# EAGLE design Remote Monitoring Hardware (EAGLE 8.1.0)
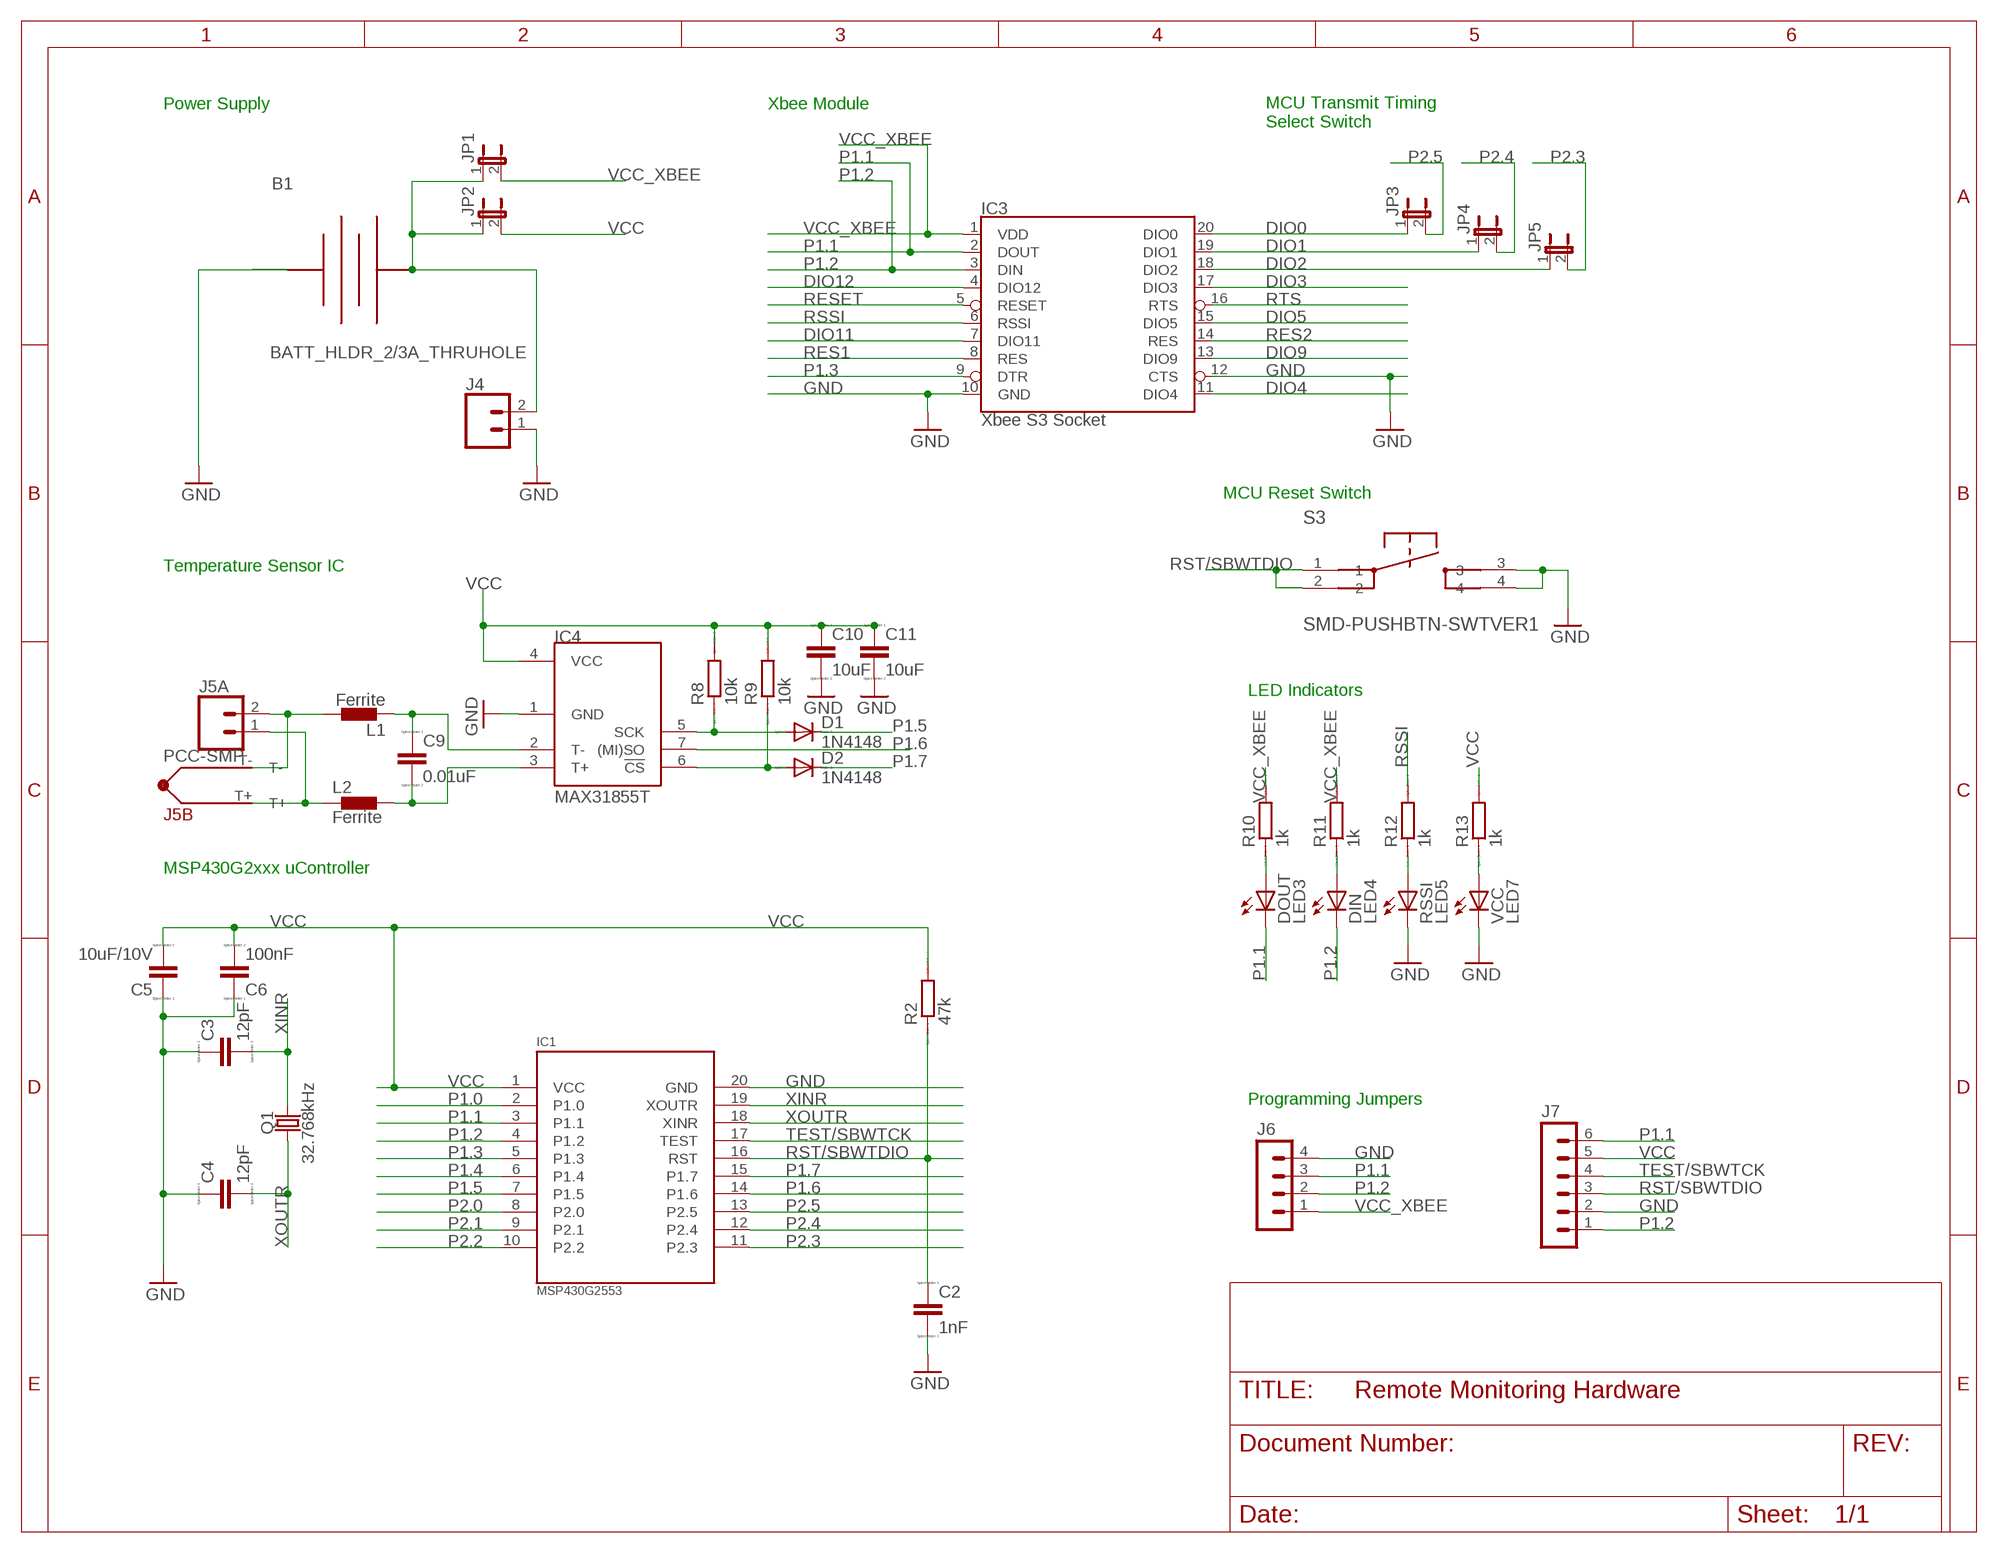
[diagram p0: schematic, sheet 1]

## Parts
B1  BATT_HLDR_2/3A_THRUHOLE  [BATT_HLDR_2/3A_THRUHOLE]
C2  1nF  C  [C0805]
C3  12pF  C  [C0805]
C4  12pF  C  [C0805]
C5  10uF/10V  C  [C0805]
C6  100nF  C  [C0805]
C9  0.01uF  C  [C0805]
C10  10uF  C  [C0805]
C11  10uF  C  [C0805]
D1  1N4148  DIODE-SOD323-R  [SOD323-R]
D2  1N4148  DIODE-SOD323-R  [SOD323-R]
DIN  LED4  LEDSML0805  [SML0805]
DOUT  LED3  LEDSML0805  [SML0805]
IC1  MSP430G2553  MSP430G2553IPW20VER2TSSOP-20  [MSP430G2553IPW20]
IC3  Xbee S3 Socket  XBEELONGPAD  [XBEE-LONGPAD]
IC4  MAX31855T  MAX6675  [SOIC8]
J4  CONN_023.5MM  [SCREWTERMINAL-3.5MM-2]
J5A  CONN_023.5MM  [SCREWTERMINAL-3.5MM-2]
J5B  PCC-SMP  [PCC-SMP]
J6  MA04-1  [MA04-1]
J7  MA06-1  [MA06-1]
JP1  JUMPER-2PTH  [1X02]
JP2  JUMPER-2PTH  [1X02]
JP3  JUMPER-2PTH  [1X02]
JP4  JUMPER-2PTH  [1X02]
JP5  JUMPER-2PTH  [1X02]
L1  Ferrite  BLM15HB121SN1  [0402]
L2  Ferrite  BLM15HB121SN1  [0402]
Q1  32.768kHz  CRYSTAL-32.768KHZSMD-2X6  [CRYSTAL-SMD-2X6-CYL]
R2  47k  R  [R0805]
R8  10k  R  [R0805]
R9  10k  R  [R0805]
R10  1k  R  [R0805]
R11  1k  R  [R0805]
R12  1k  R  [R0805]
R13  1k  R  [R0805]
RSSI  LED5  LEDSML0805  [SML0805]
S3  SMD-PUSHBTN-SWTVER1  [KPT-1187B]
VCC  LED7  LEDSML0805  [SML0805]

## Nets
1: D1.A IC4.5(SCK) R8.1
2: D2.A IC4.6(!CS) R9.1
DIO0: IC3.20(DIO0) JP3.1
DIO1: IC3.19(DIO1) JP4.1
DIO2: IC3.18(DIO2) JP5.1
DIO3: IC3.17(DIO3)
DIO4: IC3.11(DIO4)
DIO5: IC3.15(DIO5)
DIO9: IC3.13(DIO9)
DIO11: IC3.7(DIO11)
DIO12: IC3.4(DIO12)
GND: B1.NEG C2.2 C3.1 C4.1 C5.1 C6.1 C10.2 C11.2 IC1.20(GND) IC3.10(GND) IC3.12(CTS) IC4.1(GND) J4.1 J6.4 J7.2 RSSI.C S3.3 S3.4 VCC.C
N$1: B1.POS J4.2 JP1.1 JP2.1
N$4: DOUT.A R10.1
N$10: DIN.A R11.1
N$11: R12.1 RSSI.A
N$12: C9.1 IC4.2(T-) L1.1
N$13: C9.2 IC4.3(T+) L2.2
N$14: J5A.2 J5B.T- L1.2
N$15: J5A.1 J5B.T+ L2.1
N$17: R13.1 VCC.A
P1.0: IC1.2(P1.0)
P1.1: DOUT.C IC1.3(P1.1) IC3.2(DOUT) J6.3 J7.6
P1.2: DIN.C IC1.4(P1.2) IC3.3(DIN) J6.2 J7.1
P1.3: IC1.5(P1.3) IC3.9(DTR)
P1.4: IC1.6(P1.4)
P1.5: D1.C IC1.7(P1.5)
P1.6: IC1.14(P1.6) IC4.7((MI)SO)
P1.7: D2.C IC1.15(P1.7)
P2.0: IC1.8(P2.0)
P2.1: IC1.9(P2.1)
P2.2: IC1.10(P2.2)
P2.3: IC1.11(P2.3) JP5.2
P2.4: IC1.12(P2.4) JP4.2
P2.5: IC1.13(P2.5) JP3.2
RES1: IC3.8(RES)
RES2: IC3.14(RES)
RESET: IC3.5(RESET)
RSSI: IC3.6(RSSI) R12.2
RST/SBWTDIO: C2.1 IC1.16(RST) J7.3 R2.1 S3.1 S3.2
RTS: IC3.16(RTS)
TEST/SBWTCK: IC1.17(TEST) J7.4
VCC: C5.2 C6.2 C10.1 C11.1 IC1.1(VCC) IC4.4(VCC) J7.5 JP2.2 R2.2 R8.2 R9.2 R13.2
VCC_XBEE: IC3.1(VDD) J6.1 JP1.2 R10.2 R11.2
XINR: C3.2 IC1.19(XOUTR) Q1.X2
XOUTR: C4.2 IC1.18(XINR) Q1.X1

## Notes on the sheet
- Power Supply | Xbee Module
- MCU Transmit Timing 
  Select Switch
- MCU Reset Switch
- Temperature Sensor IC
- LED Indicators
- MSP430G2xxx uController
- Programming Jumpers

## Library data of the parts
B1 = custom parts:BATT_HLDR_2/3A_THRUHOLE
C2-C6 C9-C11 = eagle-ltspice:C: CAPACITOR, European symbol; SPICEMODEL: NONE; SPICEPREFIX: C
D1 D2 = diode:DIODE-: DIODE
DIN DOUT RSSI VCC = led:LED: LED OSRAM: - CHIPLED LG R971, LG N971, LY N971, LG Q971, LY Q971, LO R971, LY R971 LH N974, LH R974 LS Q976, LO Q976, LY Q976 LO Q996 - Hyper CHIPLED LW Q18S LB Q993, LB Q99A, LB R99A - SideLED LS A670, LO A670, LY A670, LG A670, LP A670 LB A673, LV A673, LT A673, LW A673 LH A674 LY A675 LS A676, LA A676, LO A676, LY A676, LW A676 LS A679, LY A679, LG A679 - Hyper Micro SIDELED® LS Y876, LA Y876, LO Y876, LY Y876 LT Y87S - SmartLED LW L88C, LW L88S LB L89C, LB L89S, LG L890 LS L89K, LO L89K, LY L89K LS L896, LA L896, LO L896, LY L896 - TOPLED LS T670, LO T670, LY T670, LG T670, LP T670 LSG T670, LSP T670, LSY T670, LOP T670, LYG T670 LG T671, LOG T671, LSG T671 LB T673, LV T673, LT T673, LW T673 LH T674 LS T676, LA T676, LO T676, LY T676, LB T676, LH T676, LSB T676, LW T676 LB T67C, LV T67C, LT T67C, LS T67K, LO T67K, LY T67K, LW E67C LS E67B, LA E67B, LO E67B, LY E67B, LB E67C, LV E67C, LT E67C LW T67C LS T679, LY T679, LG T679 LS T770, LO T770, LY T770, LG T770, LP T770 LB T773, LV T773, LT T773, LW T773 LH T774 LS E675, LA E675, LY E675, LS T675 LS T776, LA T776, LO T776, LY T776, LB T776 LHGB T686 LT T68C, LB T68C - Hyper Mini TOPLED® LB M676 - Mini TOPLED Santana® LG M470 LS M47K, LO M47K, LY M47K Source: http://www.osram.convergy.de LUXEON: - LUMILED® LXK2-PW12-R00, LXK2-PW12-S00, LXK2-PW14-U00, LXK2-PW14-V00 LXK2-PM12-R00, LXK2-PM12-S00, LXK2-PM14-U00 LXK2-PE12-Q00, LXK2-PE12-R00, LXK2-PE12-S00, LXK2-PE14-T00, LXK2-PE14-U00 LXK2-PB12-K00, LXK2-PB12-L00, LXK2-PB12-M00, LXK2-PB14-N00, LXK2-PB14-P00, LXK2-PB14-Q00 LXK2-PR12-L00, LXK2-PR12-M00, LXK2-PR14-Q00, LXK2-PR14-R00 LXK2-PD12-Q00, LXK2-PD12-R00, LXK2-PD12-S00 LXK2-PH12-R00, LXK2-PH12-S00 LXK2-PL12-P00, LXK2-PL12-Q00, LXK2-PL12-R00 Source: www.luxeon.com KINGBRIGHT: KA-3528ASYC Source: www.kingbright.com
IC1 = custom parts:MSP430G2553IPW20VER2
IC3 = SparkFun-RF:XBEE: Digi XBee and XBee Pro XBees are tiny blue chips that can communicate wirelessly with each other. They can do simple things, like replacing a couple of wires in serial communication, which is nice when you want to make a remote for your paintball vehicle. SparkFun Products SparkFun XBee Buying Guide <https://www.sparkfun.com/pages/xbee_guide> SparkFun XBee Explorer USB <https://www.sparkfun.com/products/11812> (WRL-11812) Breakout Board for XBee Module <https://www.sparkfun.com/products/8276> (WRL-8276) SparkFun XBee Explorer Regulated <https://www.sparkfun.com/products/11373> (WRL-11373) SparkFun XBee Explorer Dongle <https://www.sparkfun.com/products/11697> (WRL-11697) SparkFun XBee Shield <https://www.sparkfun.com/products/12847> (WRL-12847) SparkFun XBee Explorer Serial <https://www.sparkfun.com/products/13225> (WRL-13225)
IC4 = SparkFun-Retired:MAX6675: Cold-Junction-Compensated K-Thermocoupleto-Digital Converter (0°C to +1024°C) The MAX6675 performs cold-junction compensation and digitizes the signal from a type-K thermocouple. The data is output in a 12-bit resolution, SPI™-compatible, read-only format. This converter resolves temperatures to 0.25°C, allows readings as high as +1024°C, and exhibits thermocouple accuracy of 8LSBs for temperatures ranging from 0°C to +700°C. Dead Prototype: IC-12512; PROD_ID: IC-12512
J4 J5A = SparkFun-Connectors:CONN_02: Multi connection point. Often used as Generic Header-pin footprint for 0.1 inch spaced/style header connections On any of the 0.1 inch spaced packages, you can populate with these: Break Away Headers - Straight <https://www.sparkfun.com/products/116> (PRT-00116) Break Away Male Headers - Right Angle <https://www.sparkfun.com/products/553> (PRT-00553) Female Headers <https://www.sparkfun.com/products/115> (PRT-00115) Break Away Headers - Machine Pin <https://www.sparkfun.com/products/117> (PRT-00117) Break Away Female Headers - Swiss Machine Pin <https://www.sparkfun.com/products/743> (PRT-00743) For SCREWTERMINALS and SPRING TERMINALS visit here: Screw Terimnals on SparkFun.com <https://www.sparkfun.com/search/results?term=Screw+Terminals> (5mm/3.5mm/2.54mm spacing) This device is also useful as a general connection point to wire up your design to another part of your project. Our various solder wires solder well into these plated through hole pads. Hook-Up Wire - Assortment (Stranded, 22 AWG) <https://www.sparkfun.com/products/11375> (PRT-11375) Hook-Up Wire - Assortment (Solid Core, 22 AWG) <https://www.sparkfun.com/products/11367> (PRT-11367) View the entire wire category on our website here <https://www.sparkfun.com/categories/141> Special notes: Molex polarized connector foot print use with: PRT-08233 with associated crimp pins and housings. 2.54_SCREWTERM for use with PRT-10571. 3.5mm Screw Terminal footprints for PRT-08084 5mm Screw Terminal footprints for use with PRT-08432; PROD_ID: CONN-08399
J5B = custom parts:PCC-SMP
J6 = con-lstb:MA04-1: PIN HEADER; OC_FARNELL: unknown; OC_NEWARK: unknown
J7 = con-lstb:MA06-1: PIN HEADER; OC_FARNELL: unknown; OC_NEWARK: unknown
JP1-JP5 = SparkFun-Retired:JUMPER-2: Jumper Basic 0.1" spaced jumper. Use with breakaway headers.
L1 L2 = inductors:BLM15H: EMIFIL (R) Chip Ferrite Bead for GHz Noise Source: http://www.murata.com/ Ferrite Bead BLM15H.pdf
Q1 = SparkFun-Clocks:CRYSTAL-32.768KHZ: 32.768kHz Crystal Frequency: 32.768kHz Frequency Stability: ±20ppm Load Capacitance: 12.5pF (PTH-2X6 & SMD-3.2X1.5), 6pF (SMD-2X6) SparkFun Products: SparkFun BigTime Watch Kit <https://www.sparkfun.com/products/11734> SparkFun nRF52832 Breakout <https://www.sparkfun.com/products/13990> SparkFun Real Time Clock Module <https://www.sparkfun.com/products/12708>; PROD_ID: XTAL-07894
R2 R8-R13 = eagle-ltspice:R: RESISTOR, European symbol; SPICEMODEL: NONE; SPICEPREFIX: R
S3 = custom parts:SMD-PUSHBTN-SWT

## Net classes
0 default: width 0.203 mm, clearance 0.205 mm
1 vcc: width 0.305 mm

## Board
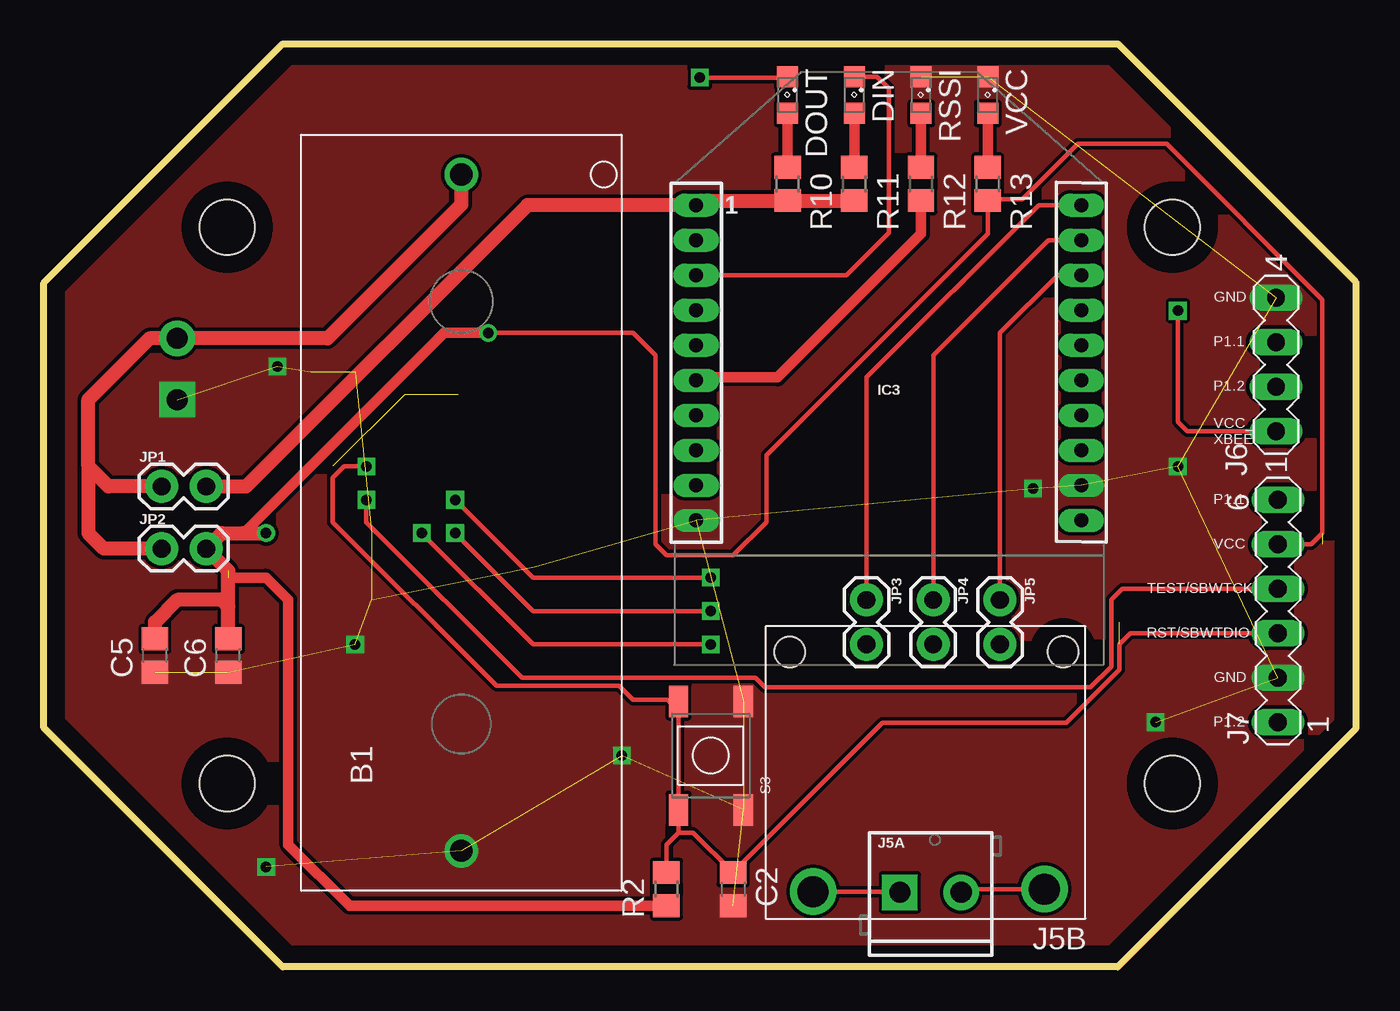
[diagram p1: board, top side]
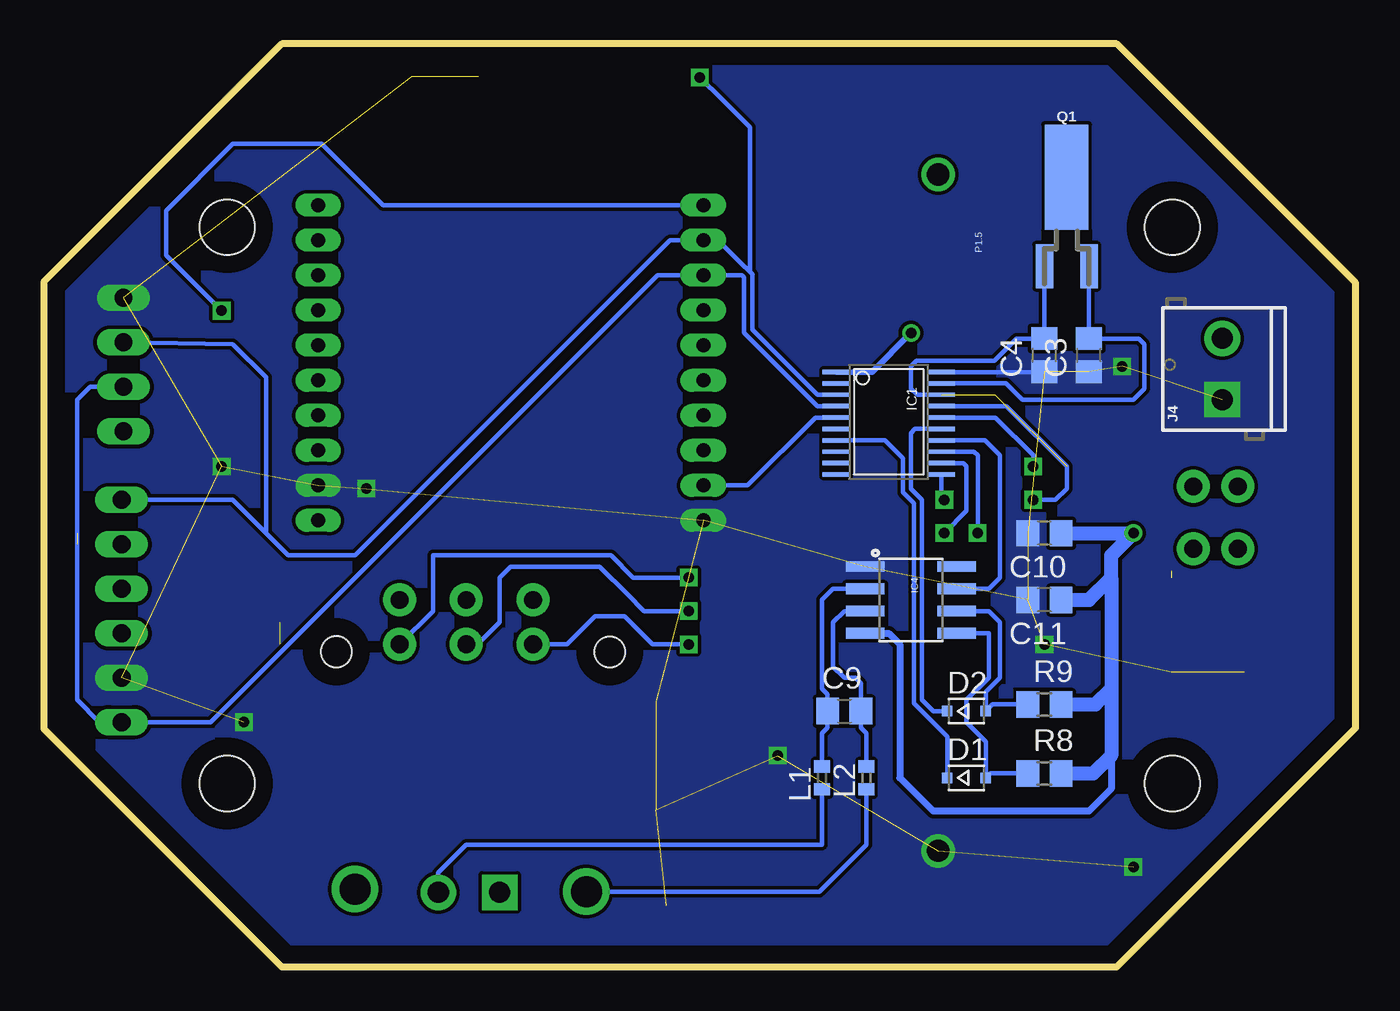
[diagram p2: board, bottom side, seen from below]

Size 74.93 x 52.7 mm. Coordinates in mm from the lower left corner, seen from the top.
Outline: 13.65,52.7 61.34,52.7 74.93,39.12 74.93,13.59 61.34,0 13.65,0 0,13.65 0,39.05 13.65,52.7
Copper layers (1*16): Top 0.035mm / dielectric 1.5mm / Bottom 0.035mm
Design rules "default *": minimum track width 7mil, minimum drill 7mil, track to track 5mil, track to pad 5mil, pad to pad 5mil, via to via 5mil, smd to smd 5mil, copper to edge 40mil, drill to drill 8mil, minimum pad ring 10mil, minimum via ring 8mil, stop-mask expansion 4mil, vias tented up to drill 0mil, thermal gap 10mil
Holes 3.17 mm at 10.48,42.23 64.45,42.23 64.45,10.48 10.48,10.48

### Footprints (pad centres in the part's own frame; a part is rotated, then mirrored left to right if it is on the bottom)
BATT_HLDR_2/3A_THRUHOLE = drill 1.27: NEG -19.05,0; POS 19.558,0
C0805 = smd 1.3 x 1.5: 1 -0.95,0; 2 0.95,0
SOD323-R = smd 0.6 x 0.6: A 1.1,0; C -1.1,0
SML0805 = smd 1.2 x 1.2: A 1.05,0; C -1.05,0
MSP430G2553IPW20 = smd 1.55 x 0.25: 1 -3,2.85; 2 -3,2.2; 3 -3,1.55; 4 -3,0.9; 5 -3,0.25; 6 -3,-0.4; 7 -3,-1.05; 8 -3,-1.7; 9 -3,-2.35; 10 -3,-3; 11 3,-3; 12 3,-2.35; 13 3,-1.7; 14 3,-1.05; 15 3,-0.4; 16 3,0.25; 17 3,0.9; 18 3,1.55; 19 3,2.2; 20 3,2.85
XBEE-LONGPAD = drill 0.8 pad 1.206 long: 1 -11,20; 2 -11,18; 3 -11,16; 4 -11,14; 5 -11,12; 6 -11,10; 7 -11,8; 8 -11,6; 9 -11,4; 10 -11,2; 11 11,2; 12 11,4; 13 11,6; 14 11,8; 15 11,10; 16 11,12; 17 11,14; 18 11,16; 19 11,18; 20 11,20
SOIC8 = smd 0.61 x 2.21: 1 -1.905,-2.616; 2 -0.635,-2.616; 3 0.635,-2.616; 4 1.905,-2.616; 5 1.905,2.616; 6 0.635,2.616; 7 -0.635,2.616; 8 -1.905,2.616
SCREWTERMINAL-3.5MM-2 = drill 1.2 pad 2.032 square: 1 0,0 | drill 1.2 pad 2.032: 2 3.5,0
PCC-SMP = drill 1.77 pad 2.54: T+ 13.207,0.14; T- 0,0 | hole 1.77: 14.542,-13.542; -1.068,-13.552
MA04-1 = drill 1.016 long: 1 -3.81,0; 2 -1.27,0; 3 1.27,0; 4 3.81,0
MA06-1 = drill 1.016 long: 1 -6.35,0; 2 -3.81,0; 3 -1.27,0; 4 1.27,0; 5 3.81,0; 6 6.35,0
1X02 = drill 1.016 pad 1.88: 1 0,0; 2 2.54,0
0402 = smd 0.7 x 0.9: 1 -0.65,0; 2 0.65,0
CRYSTAL-SMD-2X6-CYL = smd 2.5 x 6: SHEILD 0,5.08 | smd 1 x 2.5: X1 -1.27,0; X2 1.27,0
R0805 = smd 1.3 x 1.5: 1 -0.95,0; 2 0.95,0
KPT-1187B = smd 1.8 x 1.1: 1 -3.1,1.85; 2 3.1,1.85; 3 -3.1,-1.85; 4 3.1,-1.85

### Placement (x,y rotation side)
B1  23.85,25.68 90 top
C2  39.37,4.45 270 top
C3  15.24,34.92 90 bottom
C4  17.78,34.92 90 bottom
C5  6.35,17.78 90 top
C6  10.54,17.78 90 top
C9  29.21,14.61 0 bottom
C10  17.78,24.77 180 bottom
C11  17.78,20.95 180 bottom
D1  22.23,10.79 0 bottom
D2  22.23,14.61 0 bottom
DIN  46.29,49.78 270 top
DOUT  42.48,49.78 270 top
IC1  26.67,31.11 0 bottom
IC3  48.26,23.5 0 top
IC4  25.4,20.95 270 bottom
J4  7.62,32.38 90 bottom
J5A  48.9,4.25 0 top
J5B  57.15,4.45 180 top
J6  70.38,34.39 90 top
J7  70.49,20.32 90 top
JP1  6.73,27.43 0 top
JP2  6.73,23.88 0 top
JP3  46.99,20.95 270 top
JP4  50.8,20.95 270 top
JP5  54.61,20.95 270 top
L1  30.48,10.79 270 bottom
L2  27.94,10.79 90 bottom
Q1  16.51,40 0 bottom
R2  35.56,4.45 270 top
R8  17.78,11.05 0 bottom
R9  17.78,14.99 0 bottom
R10  42.48,44.7 270 top
R11  46.29,44.7 270 top
R12  50.1,44.7 270 top
R13  53.91,44.7 270 top
RSSI  50.1,49.78 270 top
S3  38.1,12.06 90 top
VCC  53.91,49.78 270 top

### Tracks (layer width: path | path; a pad name or v marks a point on that pad's centre or on a via)
1
  Bottom 0.254: R8.1 20.87,11.05 D1.A 21.13,12.87 22.23,13.97 22.23,15.25 20.96,16.52 20.96,19.04 | 20.96,19.04 20.96,19.05 | IC4.5 20.97,19.05 20.96,19.04
2
  Bottom 0.254: R9.1 20.74,14.99 D2.A 21.13,15.71 20.32,16.51 20.32,19.68 20.96,20.32 IC4.6
DIO0
  Top 0.254: 58.1,43.5 IC3.20 56.83,43.5 46.99,33.66 JP3.1
DIO1
  Top 0.254: JP4.1 50.8,34.92 57.37,41.49 IC3.19
DIO2
  Top 0.254: IC3.18 57.91,39.49 54.61,36.2 JP5.1
GND  (via drill 0.6)  (24 unrouted)
  Bottom 0.254: IC1.20 C4.1
  other vias: 63.5,13.97 56.52,27.3 33.02,12.06 12.7,5.71 17.78,18.41 13.34,34.29 64.77,28.57
  pour Top (no thermals): 0,38.73 0,13.33 0.32,13.33 13.97,-0.32 61.21,-0.32 61.53,-0.64 61.53,0.06 75.18,13.72 75.18,39.18 75.76,39.75 74.49,39.75 61.53,52.7 13.97,52.7
  pour Bottom (no thermals): 0,38.73 0,13.33 13.97,-0.64 60.96,-0.64 74.93,13.33 74.93,38.73 60.96,52.7 13.97,52.7
N$1
  Top 0.813: B1.POS 23.85,43.54 16.2,35.88 J4.2 6.04,35.88 2.54,32.38 2.54,28.57 | 2.54,28.57 2.54,24.77 3.43,23.88 JP2.1 | JP1.1 3.68,27.43 2.54,28.57
N$4
  Top 0.61: R10.1 DOUT.A
N$10
  Top 0.61: R11.1 DIN.A
N$11
  Top 0.61: R12.1 RSSI.A
N$12
  Bottom 0.254: L1.1 30.48,13.33 30.16,13.65 C9.1 30.16,15.55 30.48,15.88 30.48,20.95 29.85,21.59 IC4.2
N$13
  Bottom 0.254: L2.2 27.94,13.33 28.26,13.65 C9.2 28.26,16.2 28.58,16.51 29.21,16.51 29.85,17.14 29.85,19.68 29.21,20.32 IC4.3
N$14
  Top 0.254: J5B.T- 52.59,4.45 J5A.2
  Bottom 0.254: J5A.2 52.4,5.39 52.07,5.71 | 52.07,5.71 50.8,6.98 | L1.2 30.48,6.98 50.8,6.98 | 50.8,6.98 52.07,5.71
N$15
  Top 0.254: J5B.T+ 48.85,4.3 J5A.1
  Bottom 0.254: L2.1 27.94,6.98 30.62,4.3 J5B.T+
N$17
  Top 0.61: R13.1 VCC.A
P1.1  (via drill 0.6)
  Top 0.254: v37.47,50.77 42.42,50.77 DOUT.C
  Bottom 0.254: 34.6,39.7 34.86,39.95 34.87,39.95 36.42,41.49 IC3.2 39.15,41.49 57.15,23.5 60.96,23.5 62.23,24.77 | 34.6,39.7 34.47,39.56 34.47,36.38 30.75,32.66 IC1.3 | 34.6,39.7 34.6,47.94 36.83,50.16 36.86,50.16 v37.47,50.77 | 62.23,24.77 62.23,33.66 64.14,35.56 J6.3 | J7.6 64.14,26.67 62.23,24.77
P1.2
  Top 0.254: DIN.C 47.59,50.83 48.26,50.16 48.26,41.91 45.85,39.49 IC3.3
  Bottom 0.254: IC1.4 30.75,32.02 34.93,36.2 34.93,39.37 35.05,39.49 IC3.3 39.88,39.49 65.41,13.97 J7.1 71.76,13.97 73.03,15.24 73.03,32.38 72.29,33.12 J6.2
P1.3
  Bottom 0.254: IC1.5 30.87,31.36 34.74,27.5 IC3.9
P1.5
  Bottom 0.254: D1.C 23.33,13.15 25.22,15.05 25.22,26.48 25.86,27.11 25.86,29.03 | IC1.7 26.89,30.06 26.04,29.21 | 26.04,29.21 25.86,29.03 | 25.86,29.03 26.04,29.21
P1.6
  Bottom 0.254: IC4.7 20.96,21.59 20.32,22.23 20.32,29.21 21.18,30.06 IC1.14
P1.7
  Bottom 0.254: IC1.15 25.17,30.71 25.4,30.48 25.4,27.3 24.77,26.67 24.77,15.24 24.13,14.61 D2.C
P2.3  (via drill 0.6)
  Top 0.254: v23.5,26.67 27.94,22.23 v38.1,22.23
  Bottom 0.254: IC1.11 23.67,26.84 v23.5,26.67 | JP5.2 52.71,20.32 52.71,23.5 42.55,23.5 41.28,22.23 v38.1,22.23
P2.4  (via drill 0.6)
  Top 0.254: v23.5,24.77 27.94,20.32 v38.1,20.32
  Bottom 0.254: IC1.12 22.42,28.77 22.23,28.57 22.23,26.04 v23.5,24.77 | JP4.2 50.17,18.41 48.9,19.68 48.9,22.23 48.26,22.86 43.18,22.86 41.59,21.27 | 41.91,21.59 41.59,21.27 | 41.59,21.27 40.64,20.32 v38.1,20.32
P2.5  (via drill 0.6)
  Top 0.254: v21.59,24.77 27.94,18.41 v38.1,18.41
  Bottom 0.254: IC1.13 21.8,29.41 21.59,29.21 v21.59,24.77 | JP3.2 45.05,18.41 43.45,20.02 41.77,20.02 40.17,18.41 v38.1,18.41
RSSI
  Top 0.61: R12.2 50.1,41.85 41.91,33.66 37.42,33.66 IC3.6
RST/SBWTDIO  (via drill 0.6)  (1 unrouted)
  Top 0.254: 36.25,7.68 S3.1 36.25,14.61 | 36.25,7.68 35.56,6.98 R2.1 | 36.25,14.61 S3.2 | 36.25,7.68 37.09,7.68 C2.1 47.91,13.93 58.4,13.93 61.42,16.95 61.42,18.41 62.05,19.05 J7.3 | 36.25,14.61 35.62,15.24 33.66,15.24 32.84,16.05 25.86,16.05 16.51,25.4 16.51,27.94 17.15,28.57 v18.42,28.57
  Bottom 0.254: v18.42,28.57 18.42,29.21 20.57,31.36 IC1.16
TEST/SBWTCK  (via drill 0.6)
  Top 0.254: v18.42,26.67 18.42,25.4 27.31,16.51 40.64,16.51 41.19,15.96 59.77,15.96 60.96,17.14 60.96,20.95 61.6,21.59 J7.4
  Bottom 0.254: IC1.17 19.95,32.02 16.51,28.57 16.51,27.3 17.15,26.67 v18.42,26.67
VCC  (via drill 0.6)  (2 unrouted)
  Top 0.254: v25.4,36.2 33.66,36.2 34.93,34.92 34.93,24.13 35.56,23.5 39.37,23.5 41.28,25.4 41.28,29.21 53.91,41.85 R13.2 53.97,43.81 55.88,43.81 59.06,46.99 64.14,46.99 73.03,38.1 73.03,24.77 72.39,24.13 J7.5
  Top 0.61: 10.54,22.23 12.7,22.23 13.97,20.95 13.97,6.98 17.46,3.5 R2.2 | 11.43,24.77 22.86,36.2 v25.4,36.2
  Top 0.813: C5.2 6.35,19.68 7.62,20.95 10.16,20.95 10.54,20.57 | C6.2 10.54,20.57 | 10.54,20.57 10.54,22.61 JP2.2 10.16,24.77 11.43,24.77 v12.7,24.77
  Bottom 0.305: IC1.1 27.63,33.97 v25.4,36.2
  Bottom 0.406: 13.97,12.06 13.97,10.16 15.24,8.89 24.13,8.89 26.04,10.79 26.04,18.41 26.67,19.05 IC4.4
  Bottom 0.813: 13.97,15.88 13.97,12.06 14.99,11.05 R8.2 | 13.97,22.23 13.97,15.88 | 13.97,22.23 13.97,23.5 v12.7,24.77 C10.1 | R9.2 14.86,14.99 13.97,15.88 | C11.1 15.24,20.95 13.97,22.23
VCC_XBEE  (via drill 0.6)
  Top 0.254: v64.77,37.47 64.77,31.11 65.3,30.58 J6.1
  Top 0.813: JP1.2 11.56,27.43 27.62,43.5 IC3.1 37.52,43.75 R10.2 R11.2
  Bottom 0.254: IC3.1 55.56,43.5 59.06,46.99 64.14,46.99 67.95,43.18 67.95,40.64 v64.77,37.47
XINR
  Bottom 0.254: Q1.X2 C3.2 12.38,35.88 12.07,35.56 12.07,33.02 12.7,32.38 19.05,32.38 19.98,33.31 IC1.19
XOUTR  (2 unrouted)
  Bottom 0.254: Q1.X1 C4.2 19.37,35.88 20.64,34.6 25.09,34.6 25.4,34.29 25.4,33.02 25.05,32.66 IC1.18

### Text on the board
tNames: GND | P1.1 | P1.2 | VCC_ / XBEE | P1.1 | VCC | TEST/SBWTCK | RST/SBWTDIO | GND | P1.2
bNames: P1.5